# EAGLE design usb_breakout (EAGLE 7.5.0)
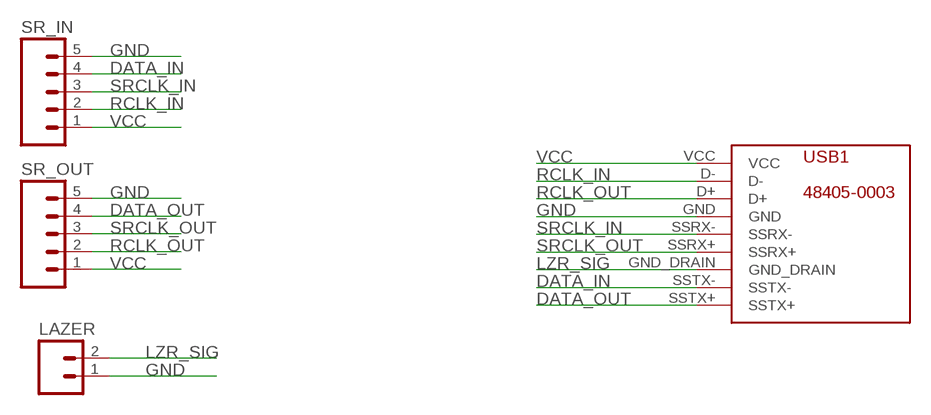
[diagram p0: schematic, sheet 1]

## Parts
LAZER  M02PTH  [1X02]
SR_IN  M05PTH  [1X05]
SR_OUT  M05PTH  [1X05]
USB1  48405-0003  [48405-0003MYVERSION]

## Nets
DATA_IN: SR_IN.4 USB1.SSTX-
DATA_OUT: SR_OUT.4 USB1.SSTX+
GND: LAZER.1 SR_IN.5 SR_OUT.5 USB1.GND
LZR_SIG: LAZER.2 USB1.GND_DRAIN
RCLK_IN: SR_IN.2 USB1.D-
RCLK_OUT: SR_OUT.2 USB1.D+
SRCLK_IN: SR_IN.3 USB1.SSRX-
SRCLK_OUT: SR_OUT.3 USB1.SSRX+
VCC: SR_IN.1 SR_OUT.1 USB1.VCC

## Library data of the parts
LAZER = SparkFun-Connectors:M02: Standard 2-pin 0.1" header. Use with - straight break away headers ( PRT-00116) - right angle break away headers (PRT-00553) - swiss pins (PRT-00743) - machine pins (PRT-00117) - female headers (PRT-00115) Molex polarized connector foot print use with: PRT-08233 with associated crimp pins and housings. 2.54_SCREWTERM for use with PRT-10571. 3.5mm Screw Terminal footprints for PRT-08084 5mm Screw Terminal footprints for use with PRT-08432
SR_IN SR_OUT = SparkFun-Connectors:M05: Header 5 Standard 5-pin 0.1" header. Use with straight break away headers (SKU : PRT-00116), right angle break away headers (PRT-00553), swiss pins (PRT-00743), machine pins (PRT-00117), and female headers (PRT-00115). Molex polarized connector foot print use with SKU : PRT-08230 with associated crimp pins and housings.
USB1 = my_try:48405-0003: USB 3.0 connector attempt, MOLEX 48405-0003

## Net classes
0 default: width 0.406 mm, drill 0.381 mm, clearance 0.305 mm

## Board
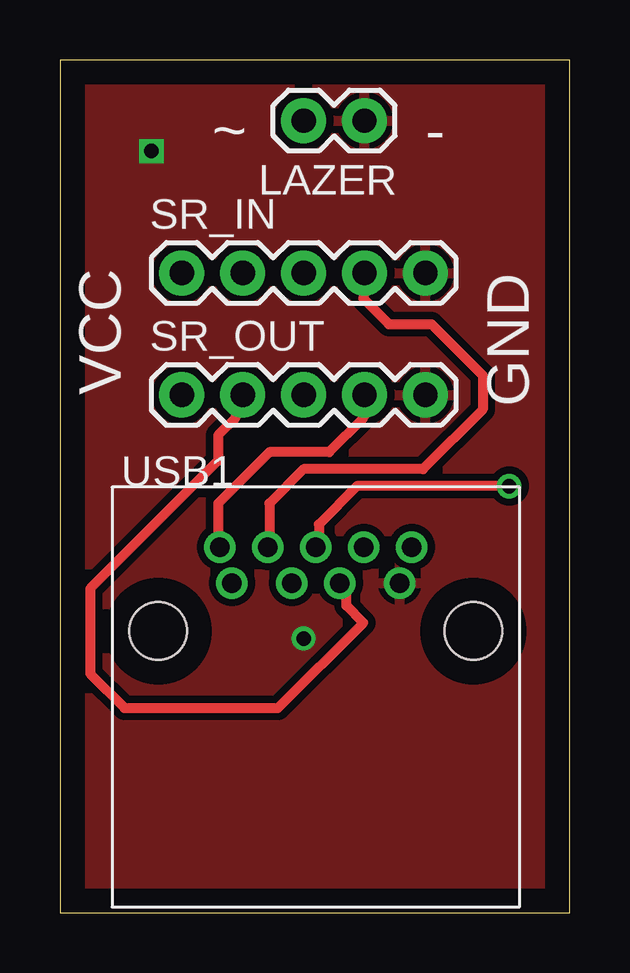
[diagram p1: board, top side]
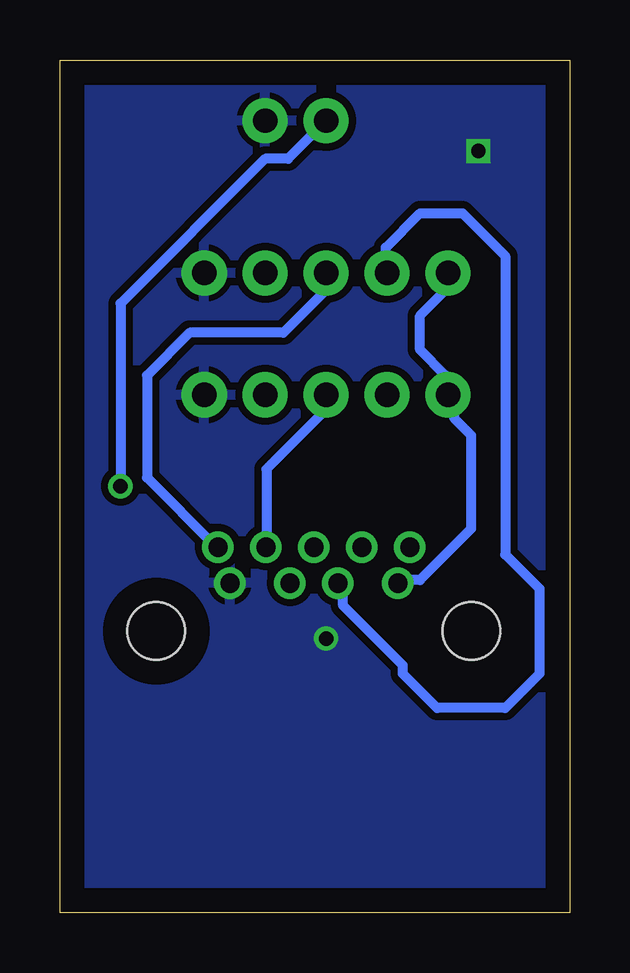
[diagram p2: board, bottom side, seen from below]

Size 21.26 x 35.55 mm. Coordinates in mm from the lower left corner, seen from the top.
Outline: 0,0 21.26,0 21.26,35.55 0,35.55 0,0
Copper layers (1*16): Top 0.035mm / dielectric 1.5mm / Bottom 0.035mm
Design rules "default": minimum track width 10mil, minimum drill 24mil, track to track 8mil, track to pad 8mil, pad to pad 8mil, via to via 8mil, smd to smd 8mil, copper to edge 40mil, drill to drill 8mil, minimum pad ring 10mil, minimum via ring 8mil, stop-mask expansion 4mil, vias tented up to drill 0mil, thermal gap 10mil

### Footprints (pad centres in the part's own frame; a part is rotated, then mirrored left to right if it is on the bottom)
1X02 = drill 1.016 pad 1.88: 1 0,0; 2 2.54,0
1X05 = drill 1.016 pad 1.88: 1 0,0; 2 2.54,0; 3 5.08,0; 4 7.62,0; 5 10.16,0
48405-0003MYVERSION = drill 0.8: D+ -6.11,-2.77; D- -8.11,-2.77; GND -3.61,-2.77; GND_DRAIN -7.11,-1.27; SSRX+ -5.11,-1.27; SSRX- -3.11,-1.27; SSTX+ -11.11,-1.27; SSTX- -9.11,-1.27; VCC -10.61,-2.77 | hole 2.4: -13.68,-4.77; -0.54,-4.77

### Placement (x,y rotation side)
LAZER  12.7,33.02 180 top
SR_IN  5.08,26.67 0 top
SR_OUT  5.08,21.59 0 top
USB1  17.78,16.51 0 top

### Tracks (layer width: path | path; a pad name or v marks a point on that pad's centre or on a via)
DATA_IN
  Top 0.406: USB1.SSTX- 8.74,15.29 8.74,17.07 10.16,18.49 15.14,18.49 17.63,20.98 17.63,22.4 15.49,24.54 13.72,24.54 12.65,25.6 12.65,26.67 SR_IN.4
DATA_OUT
  Top 0.406: USB1.SSTX+ 6.6,15.29 6.6,17.07 8.74,19.2 11.23,19.2 12.65,20.62 12.65,21.34 SR_OUT.4
GND  (via drill 0.6)
  other vias: 10.16,11.43 3.81,31.75
  pour Bottom: 21.59,35.56 0,35.56 0,0 21.59,0
  pour Top: 0,35.56 21.59,35.56 21.59,0 0,0
LZR_SIG  (via drill 0.61)
  Top 0.406: v18.73,17.78 12.38,17.78 10.79,16.19 10.79,15.24 USB1.GND_DRAIN
  Bottom 0.406: v18.73,17.78 18.73,25.4 12.7,31.43 11.75,31.43 LAZER.2
RCLK_IN
  Bottom 0.406: USB1.D- 9.45,13.51 9.45,12.8 6.96,10.31 6.96,9.96 5.54,8.53 2.69,8.53 1.27,9.96 1.27,13.51 2.69,14.94 2.69,27.38 4.47,29.16 6.25,29.16 7.67,27.74 7.67,26.67 SR_IN.2
RCLK_OUT
  Top 0.406: USB1.D+ 11.94,13.51 11.94,12.8 12.65,12.09 9.09,8.53 2.69,8.53 1.27,9.96 1.27,13.51 6.6,18.85 6.6,19.91 7.31,20.62 7.31,21.34 SR_OUT.2
SRCLK_IN
  Bottom 0.406: SR_IN.3 10.16,25.96 11.94,24.18 15.85,24.18 17.63,22.4 17.63,18.14 14.78,15.29 USB1.SSRX-
SRCLK_OUT
  Bottom 0.406: SR_OUT.3 10.16,20.98 12.65,18.49 12.65,15.29 USB1.SSRX+
VCC
  Bottom 0.406: USB1.VCC 6.96,13.87 6.25,13.87 4.12,16 4.12,19.91 4.83,20.62 4.83,21.34 SR_OUT.1 5.18,21.69 5.18,22.4 6.25,23.47 6.25,24.89 5.18,25.96 5.18,26.67 SR_IN.1

### Text on the board
tNames: ~ | - | GND | VCC